# Altium schematic sheet FilterControl.Schematic.SchDoc
size A
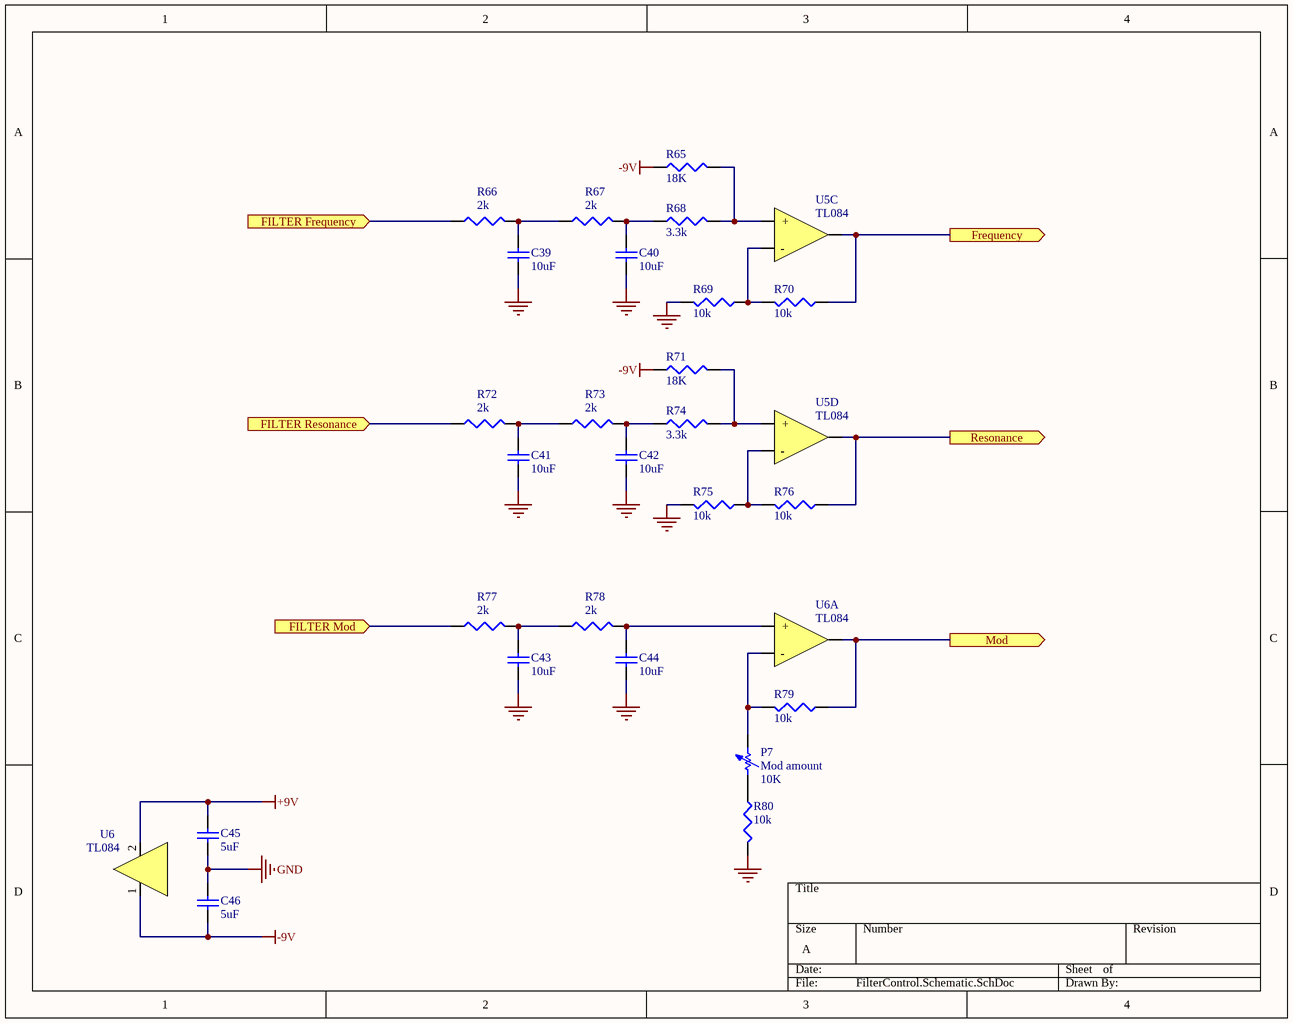
[diagram p0: FilterControl.Schematic.SchDoc]

## Parts
C39  10uF  [CAPC1608N - cap]
C40  10uF  [CAPC1608N - cap]
C41  10uF  [CAPC1608N - cap]
C42  10uF  [CAPC1608N - cap]
C43  10uF  [CAPC1608N - cap]
C44  10uF  [CAPC1608N - cap]
C45  5uF  [CAPC1608N - cap]
C46  5uF  [CAPC1608N - cap]
P7  Mod amount  value 10K  [CAPC1608N]
R65  18K  [CAPC1608N]
R66  2k  [CAPC1608N]
R67  2k  [CAPC1608N]
R68  3.3k  [CAPC1608N]
R69  10k  [CAPC1608N]
R70  10k  [CAPC1608N]
R71  18K  [CAPC1608N]
R72  2k  [CAPC1608N]
R73  2k  [CAPC1608N]
R74  3.3k  [CAPC1608N]
R75  10k  [CAPC1608N]
R76  10k  [CAPC1608N]
R77  2k  [CAPC1608N]
R78  2k  [CAPC1608N]
R79  10k  [CAPC1608N]
R80  10k  [CAPC1608N]
U5C  TL084  [TL084 - 3pads]
U5D  TL084  [TL084 - 3pads]
U6  TL084  [TL084 - Alim]
U6A  TL084  [TL084 - 3pads]

## Ports
FILTER Frequency (in), FILTER Mod (in), FILTER Resonance (in), Frequency (out), Mod (out), Resonance (out)

## Nets
+9V: C45.1 U6.2(VCC-)
-9V: C46.2 R65.1 R71.1 U6.1(VCC+)
GND: C39.1 C40.1 C41.1 C42.1 C43.1 C44.1 C45.2 C46.1 R69.2 R75.2 R80.2
FILTER Frequency: R66.1 ; port FILTER Frequency
FILTER Mod: R77.1 ; port FILTER Mod
FILTER Resonance: R72.1 ; port FILTER Resonance
Frequency: R70.1 U5C.1(OUT) ; port Frequency
Mod: R79.1 U6A.1(OUT) ; port Mod
Resonance: R76.1 U5D.1(OUT) ; port Resonance
NetC39_2: C39.2 R66.2 R67.1
NetC40_2: C40.2 R67.2 R68.1
NetC41_2: C41.2 R72.2 R73.1
NetC42_2: C42.2 R73.2 R74.1
NetC43_2: C43.2 R77.2 R78.1
NetC44_2: C44.2 R78.2 U6A.3(+)
NetP7_1: P7.1 R80.1
NetP7_2: P7.2 R79.2 U6A.2(-)
NetR65_2: R65.2 R68.2 U5C.3(+)
NetR69_1: R69.1 R70.2 U5C.2(-)
NetR71_2: R71.2 R74.2 U5D.3(+)
NetR75_1: R75.1 R76.2 U5D.2(-)

## Library data of the parts
C39-C44 = Cap Semi: Capacitor (Semiconductor SIM Model); Value: 10u; Published: 8-Jun-2000; LatestRevisionDate: 29-May-2009; LatestRevisionNote: IPC-7351 Footprint Added.; PackageReference: C1206; Publisher: Altium Limited; PackageDescription: Chip Capacitor
C45 C46 = Cap Semi: Capacitor (Semiconductor SIM Model); Value: 4.7u; Published: 8-Jun-2000; LatestRevisionDate: 29-May-2009; LatestRevisionNote: IPC-7351 Footprint Added.; PackageReference: C1206; Publisher: Altium Limited; PackageDescription: Chip Capacitor
P7 = Res Adj1: Variable Resistor; Set Position: 0.5; Published: 8-Jun-2000; LatestRevisionDate: 17-Jul-2002; LatestRevisionNote: Re-released for DXP Platform.; PackageReference: AXIAL-0.7; Publisher: Altium Limited; PackageDescription: Axial Device, Thru-Hole; 2 Leads; 0.7 in Pin Spacing
R65-R80 = Res3: Resistor; Published: 8-Jun-2000; LatestRevisionDate: 29-May-2009; LatestRevisionNote: IPC-7351 Footprint Added.; PackageReference: J1-0603; Publisher: Altium Limited; PackageDescription: Chip Resistor
  R65 R71: Value: 18K
  R66 R67 R72 R73 R77 R78: Value: 2K
  R68 R74: Value: 3.3K
  R69 R70 R75 R76 R79 R80: Value: 10K
U5C U5D U6A = TL084: Ref_Fabricant: TL084BCD; Fabricant: Fairchild Semiconductor; Ref_Farnell: 9593438; Datasheet: http://www.farnell.com/datasheets/1882473.pdf
U6 = TL_CLEAN: Ref_Fabricant: TL084BCD; Fabricant: Fairchild Semiconductor; Datasheet: http://www.farnell.com/datasheets/1882473.pdf; Ref_Farnell: 9593438